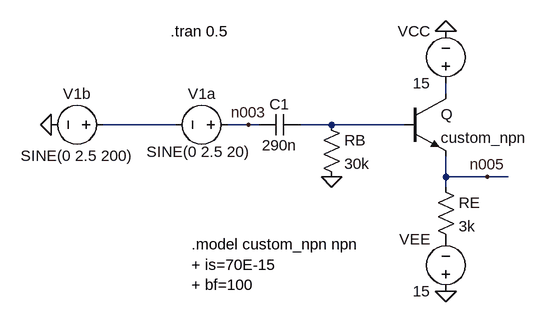
[diagram p0: schematic c02ex08s01.asc]
c02ex08s01.asc, the LTspice schematic file:
Version 4
SHEET 1 880 680
WIRE 256 272 256 256
WIRE -160 320 -272 320
WIRE -48 320 -80 320
WIRE -32 320 -48 320
WIRE 80 320 32 320
WIRE 192 320 80 320
WIRE 256 400 256 368
WIRE 320 400 256 400
WIRE 352 400 320 400
WIRE 256 416 256 400
FLAG 256 576 0
FLAG 80 400 0
FLAG 256 176 0
FLAG -352 320 0
FLAG -48 320 n003
FLAG 320 400 n005
SYMBOL voltage -64 320 R90
WINDOW 0 -32 56 VBottom 2
WINDOW 3 57 61 VBottom 2
WINDOW 123 0 0 Left 0
WINDOW 39 0 0 Left 0
SYMATTR InstName V1a
SYMATTR Value SINE(0 2.5 20)
SYMBOL res 64 304 R0
SYMATTR InstName RB
SYMATTR Value 30k
SYMBOL res 240 400 R0
SYMATTR InstName RE
SYMATTR Value 3k
SYMBOL cap -32 336 R270
WINDOW 0 32 32 VTop 2
WINDOW 3 0 32 VBottom 2
SYMATTR InstName C1
SYMATTR Value 290n
SYMBOL npn 192 272 R0
SYMATTR InstName Q
SYMATTR Value custom_npn
SYMBOL voltage 256 592 R180
WINDOW 0 24 96 Left 2
WINDOW 3 24 16 Left 2
WINDOW 123 0 0 Left 0
WINDOW 39 0 0 Left 0
SYMATTR InstName VEE
SYMATTR Value 15
SYMBOL voltage 256 272 R180
WINDOW 0 24 96 Left 2
WINDOW 3 24 16 Left 2
WINDOW 123 0 0 Left 0
WINDOW 39 0 0 Left 0
SYMATTR InstName VCC
SYMATTR Value 15
SYMBOL voltage -256 320 R90
WINDOW 0 -32 56 VBottom 2
WINDOW 3 32 56 VTop 2
WINDOW 123 0 0 Left 0
WINDOW 39 0 0 Left 0
SYMATTR InstName V1b
SYMATTR Value SINE(0 2.5 200)
TEXT -168 176 Left 2 !.tran 0.5
TEXT -136 504 Left 2 !.model custom_npn npn\n+ is=70E-15\n+ bf=100

The netlist it stands for:
* c02ex08s01.asc
V1a n003 N002 SINE(0 2.5 20)
RB N004 0 30k
RE n005 P001 3k
C1 n003 N004 290n
Q N001 N004 n005 0 custom_npn
VEE 0 P001 15
VCC N001 0 15
V1b N002 0 SINE(0 2.5 200)
.model NPN NPN
.model PNP PNP
.lib standard.bjt
.tran 0.5
.model custom_npn npn
+ is=70E-15
+ bf=100
.backanno
.end